# EAGLE schematic untitled (EAGLE 6.3)
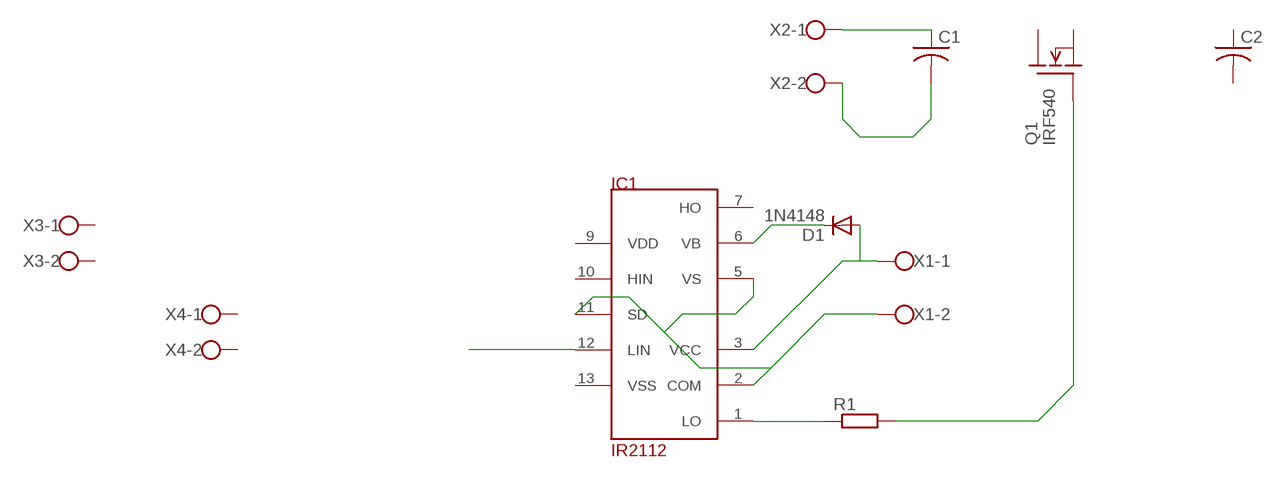
[diagram p0: schematic, sheet 1]

## Parts
C1  C-US050-045X075  [C050-045X075]
C2  C-US050-045X075  [C050-045X075]
D1  1N4148  [DO35-10]
IC1  IR2112  [DIL14]
Q1  IRF540  [TO220]
R1  R-EU_0207/10  [0207/10]
X1  AK300/2  [AK300/2]
X2  AK300/2  [AK300/2]
X3  AK300/2  [AK300/2]
X4  AK300/2  [AK300/2]

## Nets
COM: IC1.2(COM) IC1.5(VS) IC1.11(SD) X1.2
N$1: IC1.12(LIN)
N$2: C1.2 X2.2
N$3: IC1.1(LO) R1.1
N$4: C1.1 X2.1
N$5: Q1.1(G) R1.2
VB: D1.C IC1.6(VB)
VCC: D1.A IC1.3(VCC) X1.1
Unconnected: C2.1 C2.2 IC1.7(HO) IC1.9(VDD) IC1.10(HIN) IC1.13(VSS) Q1.2(D) Q1.3(S) X3.1 X3.2 X4.1 X4.2

## Library data of the parts
C1 C2 = adafruit:C-US: CAPACITOR, American symbol
D1 = diode-1:1N4148: DIODE high speed (Philips)
IC1 = ir2112:IR2112
Q1 = transistor-fet+irf7201:IRF540: N-Channel Enhancement MOSFET (HEXFET); 100V; 28A; 0,077Ohm
R1 = rcl:R-EU_: RESISTOR, European symbol
X1-X4 = con-ptr500+:AK300/2: CONNECTOR